# Altium project MAGI'sUSBASP.PrjPcb
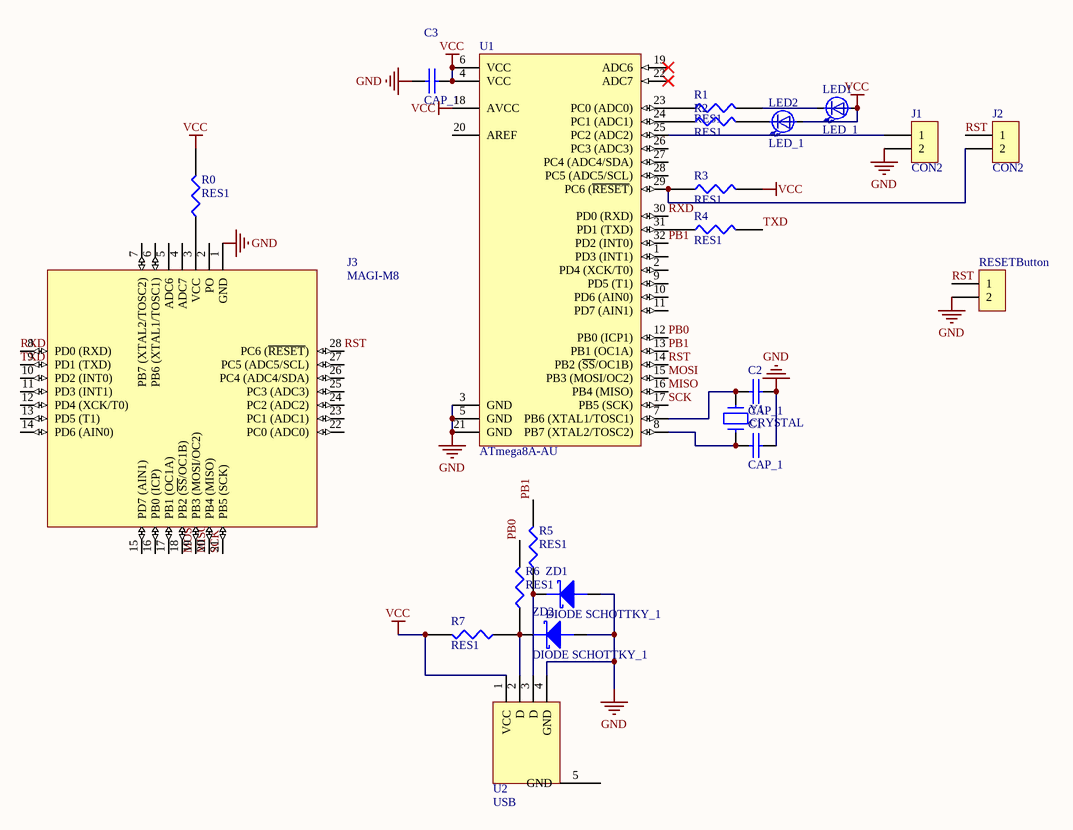
[diagram p0: MAGI'sUSBASP.SchDoc]
1 sheet, 22 parts. Net scope: global (net labels, ports and power ports of the same name join across sheets).
Board file: MAGI'sUSBASP.PcbDoc

## Sheet MAGI'sUSBASP.SchDoc
size A4

### Parts
C1  CAP_1  [6-0805_M]
C2  CAP_1  [6-0805_M]
C3  CAP_1  [6-0805_M]
J1  CON2  [6-0805_M]
J2  CON2  [6-0805_M]
J3  MAGI-M8  [MAGI-M8]
LED1  LED_1  [6-0805_M]
LED2  LED_1  [6-0805_M]
R0  RES1  [6-0805_M]
R1  RES1  [6-0805_M]
R2  RES1  [6-0805_M]
R3  RES1  [6-0805_M]
R4  RES1  [6-0805_M]
R5  RES1  [6-0805_M]
R6  RES1  [6-0805_M]
R7  RES1  [6-0805_M]
RESETButton  (no value)  [SKRELGE010]
U1  ATmega8A-AU  [32A_N]
U2  USB  [MicroUSB]
Y1  CRYSTAL  [4SMX]
ZD1  DIODE SCHOTTKY_1  [C1206]
ZD2  DIODE SCHOTTKY_1  [C1206]

### Nets
GND: C1.1 C2.1 C3.1 J1.2 J3.1(GND) RESETButton.2 U1.3(GND) U1.5(GND) U1.21(GND) U2.4(GND) ZD1.1(A) ZD2.1(A)
VCC: C3.2 LED1.1(A) LED2.1(A) R0.2 R3.2 R7.2 U1.4(VCC) U1.6(VCC) U1.18(AVCC) U2.1(VCC)
MISO: J3.20(PB4_(MISO)) U1.16(PB4_(MISO))
MOSI: J3.19(PB3_(MOSI/OC2)) U1.15(PB3_(MOSI/OC2))
PB0: R6.2 U1.12(PB0_(ICP1))
PB1: R5.2 U1.13(PB1_(OC1A)) U1.32(PD2_(INT0))
RST: J2.1 J3.28(PC6_(~{RESET})) RESETButton.1 U1.14(PB2_(~{SS}/OC1B))
RXD: J3.8(PD0_(RXD)) U1.30(PD0_(RXD))
SCK: J3.21(PB5_(SCK)) U1.17(PB5_(SCK))
TXD: J3.9(PD1_(TXD)) R4.2
NetC1_2: C1.2 U1.8(PB7_(XTAL2/TOSC2)) Y1.2
NetC2_2: C2.2 U1.7(PB6_(XTAL1/TOSC1)) Y1.1
NetJ1_1: J1.1 U1.25(PC2_(ADC2))
NetJ2_2: J2.2 R3.1 U1.29(PC6_(~{RESET}))
NetJ3_3: J3.3(VCC) R0.1
NetLED1_2: LED1.2(K) R1.2
NetLED2_2: LED2.2(K) R2.2
NetR1_1: R1.1 U1.23(PC0_(ADC0))
NetR2_1: R2.1 U1.24(PC1_(ADC1))
NetR4_1: R4.1 U1.31(PD1_(TXD))
NetR5_1: R5.1 U2.3(D) ZD1.2(K)
NetR6_1: R6.1 R7.1 U2.2(D) ZD2.2(K)

Not connected (* = marked no-connect by the designer): J3 2(PO) 4(ADC7) 5(ADC6) 6(PB6_(XTAL1/TOSC1)) 7(PB7_(XTAL2/TOSC2)) 10(PD2_(INT0)) 11(PD3_(INT1)) 12(PD4_(XCK/T0)) 13(PD5_(T1)) 14(PD6_(AIN0)) 15(PD7_(AIN1)) 16(PB0_(ICP)) 17(PB1_(OC1A)) 18(PB2_(~{SS}/OC1B)) 22(PC0_(ADC0)) 23(PC1_(ADC1)) 24(PC2_(ADC2)) 25(PC3_(ADC3)) 26(PC4_(ADC4/SDA)) 27(PC5_(ADC5/SCL)); U1 1(PD3_(INT1)) 2(PD4_(XCK/T0)) 9(PD5_(T1)) 10(PD6_(AIN0)) 11(PD7_(AIN1)) 19(ADC6)* 20(AREF) 22(ADC7)* 26(PC3_(ADC3)) 27(PC4_(ADC4/SDA)) 28(PC5_(ADC5/SCL)); U2 5(GND)

### Library data of the parts
C1-C3 = CAP_1: Capacitor
J1 J2 RESETButton = CON2: Connector
U1 = ATmega8A-AU: 8-bit AVR Microcontroller, 8KB Flash, 512 Bytes EEPROM, 1KB SRAM, 32-pin TQFP, Industrial Grade (-40癈 to 85癈); Published: 1-Apr-2010; DatasheetVersion: revC, Jul-2009; PackageVersion: revB, Oct-2001; PackageReference: 32A; Publisher: Altium Limited; PackageDescription: 32-Lead, 7x7x1.0 mm Body, 0.8mm Lead Pitch, Thin Profile Plastic Quad Flat Package (TQFP); Supplier 1: Digi-Key; Supplier Part Number 1: ATMEGA8A-AU-ND; Supplier 2: Farnell; Supplier Part Number 2: 1748532; Supplier 3: Mouser; Supplier Part Number 3: 556-ATMEGA8A-AU; Code_JEDEC: MS-026-ABA; ComponentLink1Description: Manufacturer Link; ComponentLink1URL: http://www.atmel.com/products/avr/default.asp?; ComponentLink2Description: ATmega8A Datasheet; ComponentLink2URL: http://www.atmel.com/dyn/resources/prod_documents/doc8159.pdf; ComponentLink3Description: ATmega8A Summary; ComponentLink3URL: http://www.atmel.com/dyn/resources/prod_documents/8159S.pdf; ComponentLink4Description: Atmel.com Home; ComponentLink4URL: http://www.atmel.com
ZD1 ZD2 = DIODE SCHOTTKY_1: Schottky Diode